# Altium project AOTF_signal_conversion_circuit_4.PrjPcb
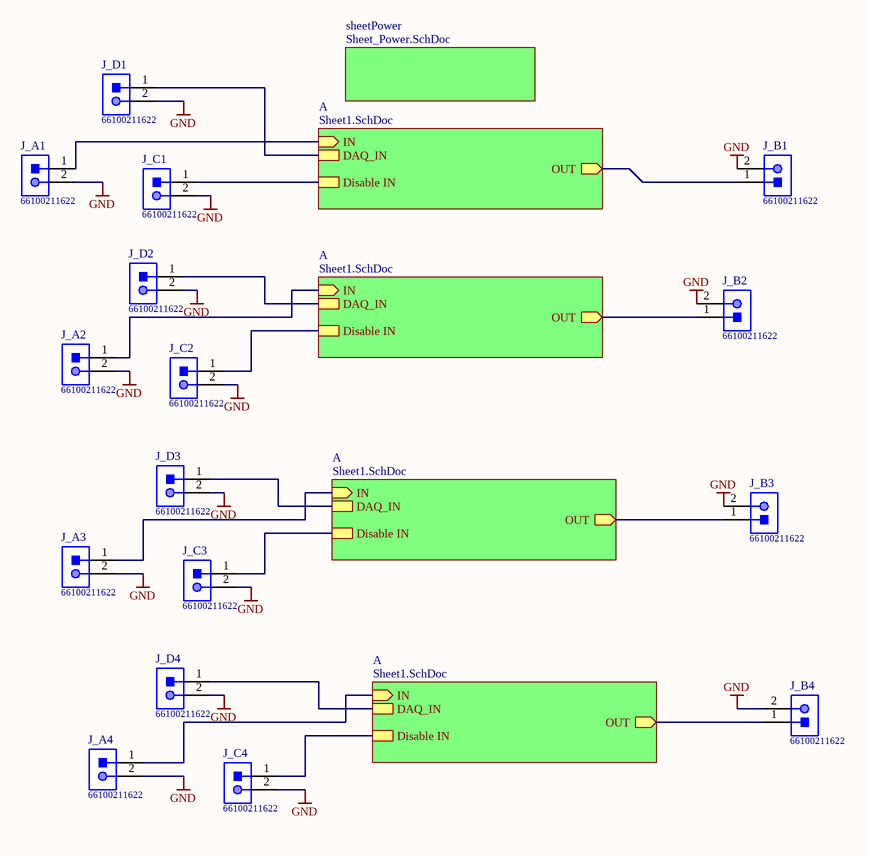
[diagram p0: sheet_top.SchDoc]
4 sheets, 136 parts. Net scope: hierarchical (ports join the sheet entries above them; power ports are global).
Board file: board.PcbDoc
Sheets:
  sheet_top.SchDoc
    sheetPower = Sheet_Power.SchDoc
    A = Sheet1.SchDoc
    A = Sheet1.SchDoc
    A = Sheet1.SchDoc
    A = Sheet1.SchDoc
  Sheet2.SchDoc

## Sheet sheet_top.SchDoc
size A4

### Parts
J_A1  66100211622  [66100211622]
J_A2  66100211622  [66100211622]
J_A3  66100211622  [66100211622]
J_A4  66100211622  [66100211622]
J_B1  66100211622  [66100211622]
J_B2  66100211622  [66100211622]
J_B3  66100211622  [66100211622]
J_B4  66100211622  [66100211622]
J_C1  66100211622  [66100211622]
J_C2  66100211622  [66100211622]
J_C3  66100211622  [66100211622]
J_C4  66100211622  [66100211622]
J_D1  66100211622  [66100211622]
J_D2  66100211622  [66100211622]
J_D3  66100211622  [66100211622]
J_D4  66100211622  [66100211622]

### Sub-sheets
A = Sheet1.SchDoc: OUT (out), IN (in), Disable IN, DAQ_IN
A = Sheet1.SchDoc: OUT (out), IN (in), Disable IN, DAQ_IN
A = Sheet1.SchDoc: OUT (out), IN (in), Disable IN, DAQ_IN
A = Sheet1.SchDoc: OUT (out), IN (in), Disable IN, DAQ_IN
sheetPower = Sheet_Power.SchDoc: no entries

### Nets
GND: J_A1.2 J_A2.2 J_A3.2 J_A4.2 J_B1.2 J_B2.2 J_B3.2 J_B4.2 J_C1.2 J_C2.2 J_C3.2 J_C4.2 J_D1.2 J_D2.2 J_D3.2 J_D4.2
NetJ_A1_1: J_A1.1 ; sheet A/IN
NetJ_A2_1: J_A2.1 ; sheet A/IN
NetJ_A3_1: J_A3.1 ; sheet A/IN
NetJ_A4_1: J_A4.1 ; sheet A/IN
NetJ_B1_1: J_B1.1 ; sheet A/OUT
NetJ_B2_1: J_B2.1 ; sheet A/OUT
NetJ_B3_1: J_B3.1 ; sheet A/OUT
NetJ_B4_1: J_B4.1 ; sheet A/OUT
NetJ_C1_1: J_C1.1 ; sheet A/Disable IN
NetJ_C2_1: J_C2.1 ; sheet A/Disable IN
NetJ_C3_1: J_C3.1 ; sheet A/Disable IN
NetJ_C4_1: J_C4.1 ; sheet A/Disable IN
NetJ_D1_1: J_D1.1 ; sheet A/DAQ_IN
NetJ_D2_1: J_D2.1 ; sheet A/DAQ_IN
NetJ_D3_1: J_D3.1 ; sheet A/DAQ_IN
NetJ_D4_1: J_D4.1 ; sheet A/DAQ_IN

### Notes on the sheet
- Title
- Size:
- Modified:
- A4
- Project:
- Time:
- Sheet
- of
- Created:
- Author:
- Prj. #:
- Alfons Riedinger
- File:
- Revision:

### Library data of the parts
J_A1-J_A4 J_B1-J_B4 J_C1-J_C4 J_D1-J_D4 = CMP-001-0161-A.3: WR-WTB 2.54 mm Male Vertical Shrouded Header 2 Pins; Manufacturer: Wurth Electronics; Supplier Part Number: 732-14102-ND; PartNumber: 66100211622; Supplier: Digi-Key

## Sheet Sheet_Power.SchDoc
size A4
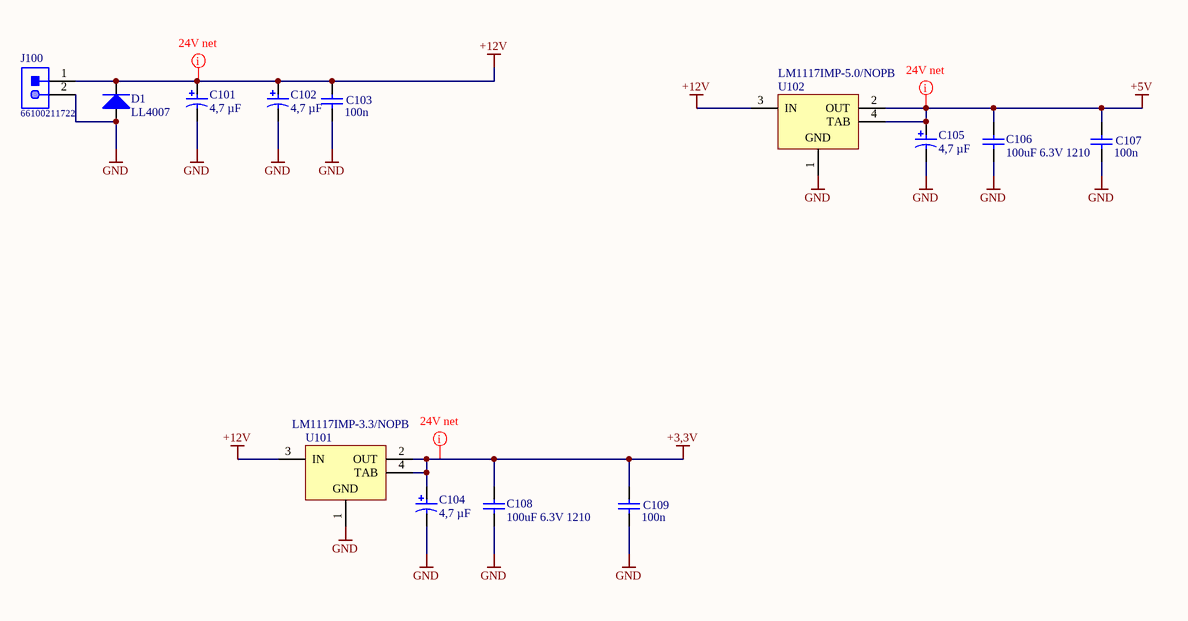
[diagram p1: Sheet_Power.SchDoc]

### Parts
C101  4,7 µF  [A Package]
C102  4,7 µF  [A Package]
C103  100n  [CAPC2013X88X50ML20T25]
C104  4,7 µF  [A Package]
C105  4,7 µF  [A Package]
C106  100uF 6.3V 1210  [885012109004-Footprint-1]
C107  100n  [CAPC2013X88X50ML20T25]
C108  100uF 6.3V 1210  [885012109004-Footprint-1]
C109  100n  [CAPC2013X88X50ML20T25]
D1  LL4007  [LL4007]
J100  66100211722  [66100211722]
U101  LM1117IMP-3.3/NOPB  [DCY0004A_N]
U102  LM1117IMP-5.0/NOPB  [DCY0004A_M]

### Nets
+3,3V: C104.1 C108.2 C109.2 U101.2(OUT) U101.4(TAB)
+5V: C105.1 C106.2 C107.2 U102.2(OUT) U102.4(TAB)
+12V: C101.1 C102.1 C103.2 D1.2(K) J100.1 U101.3(IN) U102.3(IN)
GND: C101.2 C102.2 C103.1 C104.2 C105.2 C106.1 C107.1 C108.1 C109.1 D1.1(A) J100.2 U101.1(GND) U102.1(GND)

### Layout directives
net class 24V_net: +3,3V, +5V, +12V

### Library data of the parts
C101 C102 C104 C105 = CMP-001-0039-3: 4,7 µF; 6V; Gr. A; T491A475K006AT; Manufacturer: KEMET; Capacitance: 4.7µF; ESR (Equivalent Series Resistance): 6 Ohm; Lifetime @ Temp.: 2000 Hrs @ 85°C; Tolerance: ±10%; Type: Molded; Voltage - Rated: 6.3V; ComponentLink1Description: KEM_T2005_T491.pdf; ComponentLink1URL: http://www.kemet.com/Lists/ProductCatalog/Attachments/254/KEM_T2005_T491.pdf; Failure Rate: -; Features: General Purpose; Height - Seated (Max): 0.071" (1.80mm); Lead Spacing: -; Manufacturer Size Code: A; Mounting Type: Surface Mount; Operating Temperature: -55°C ~ 125°C; Package / Case: 1206 (3216 Metric); Packaging: Cut Tape (CT); Part Status: Active; Size / Dimension: 0.126" L x 0.063" W (3.20mm x 1.60mm); Supplier: Digi-Key; Supplier Part Number: 399-9717-1-ND; PartNumber: T491A475K006AT
C103 C107 C109 = CMP-001-0082-2: generic 0805 COG oder X7R Vielschichtkondensatoren max. +/-10%
C106 C108 = CMP-001-0186-3: Ceramic Capacitor, Ceramic, 100uF, 6.3V; PartNumber: 885012109004; REACH SVHC: Yes; Dielectric Material: Ceramic; Capacitor Type: Ceramic; Number of Pins: 2; RoHS Compliant: Yes
D1 = CMP-001-0049-2: LL4007;  Vf 1,1V @ 1A, If = 1A; Manufacturer: TAIWAN SEMICONDUCTOR; PartNumber: LL4007G L2; Bauform - Diode: DO-213; Betriebstemperatur, max.: 175; Diodenkonfiguration: Einfach; Durchlassspannung Vf max.: 1.1; Durchlassstrom (mittlerer) If(AV): 1; Spitzendurchlassstrom Ifsm, max.: 25; SVHC: No SVHC (20-Jun-2016; Verpackung: Gurtabschnitt; Anzahl der Pins: -; ComponentLink1Description: 2182652.pdf; ComponentLink1URL: http://www.farnell.com/datasheets/2182652.pdf; Periodische Sperrspannung Vrrm, max.: 1; Produktpalette: -; Sperrerholzeit Trr, max.: -; Supplier: Farnell; Supplier Part Number: 2677381
J100 = CMP-00524-A.1: Intercom Male Shrouded Locking Header WR-WTB, THT, Right Angled, pitch 2.54 mm, 1 x 2 position; Manufacturer: Wurth Elektronik; Pitch: 2.54mm; Working Voltage: 50VAC; Contact Resistance: 20mOhm; Position: 1x2; Gender: Male; Manufacturer URL: http://www.we-online.de; Operating Temperature: -40to125degC; Packaging: Box; Package Reference: 66100211722; Part Number: 66100211722; Mounting Technology: THT; Datasheet URL: https://katalog.we-online.de/em/datasheet/6610xx11722.pdf; Orientation: RightAngled; Publisher: WurthElektronik
U101 = CMP-00484-1: 800mA Low-Dropout Linear Regulator, 4-pin SOT-223, Pb-Free; Manufacturer: Texas Instruments; PackageTopMarking: XYTT*N05B; PowerWise: N; High-Reliability: Y; CompType: LDO IC; Code_IPC: SOT223-4; PackageReference: DCY0004A; PinCount: 4; PackageDescription: Molded SOT-223, 6.50 x 3.56 x 1.6mm Body, 4 Lead, 2.3mm Pitch; PartNumber: LM1117IMP-3.3/NOPB; RoHS: Y; ComponentLink1Description: Datasheet URL; Code_JEDEC: TO-261-AA; ComponentLink1URL: http://www.ti.com/general/docs/lit/getliterature.tsp?genericPartNumber=LM1117-N&fileType=pdf
U102 = CMP-00485-1: 800mA Low-Dropout Linear Regulator, 4-pin SOT-223, Pb-Free; Manufacturer: Texas Instruments; PackageTopMarking: XYTT*N06B; CompType: LDO IC; PowerWise: N; High-Reliability: Y; RoHS: Y; Code_JEDEC: TO-261-AA; ComponentLink1URL: http://www.ti.com/general/docs/lit/getliterature.tsp?genericPartNumber=LM1117-N&fileType=pdf; Code_IPC: SOT223-4; ComponentLink1Description: Datasheet URL; PartNumber: LM1117IMP-5.0/NOPB; PackageReference: DCY0004A; PinCount: 4; PackageDescription: Molded SOT-223, 6.50 x 3.56 x 1.6mm Body, 4 Lead, 2.3mm Pitch

## Sheet Sheet1.SchDoc
size A4; Author: Christian Kieser; Engineer: Christian Kieser
Used 4 times, as channels A, A, A, A. Parts and nets are listed once, with the designators drawn on the sheet.
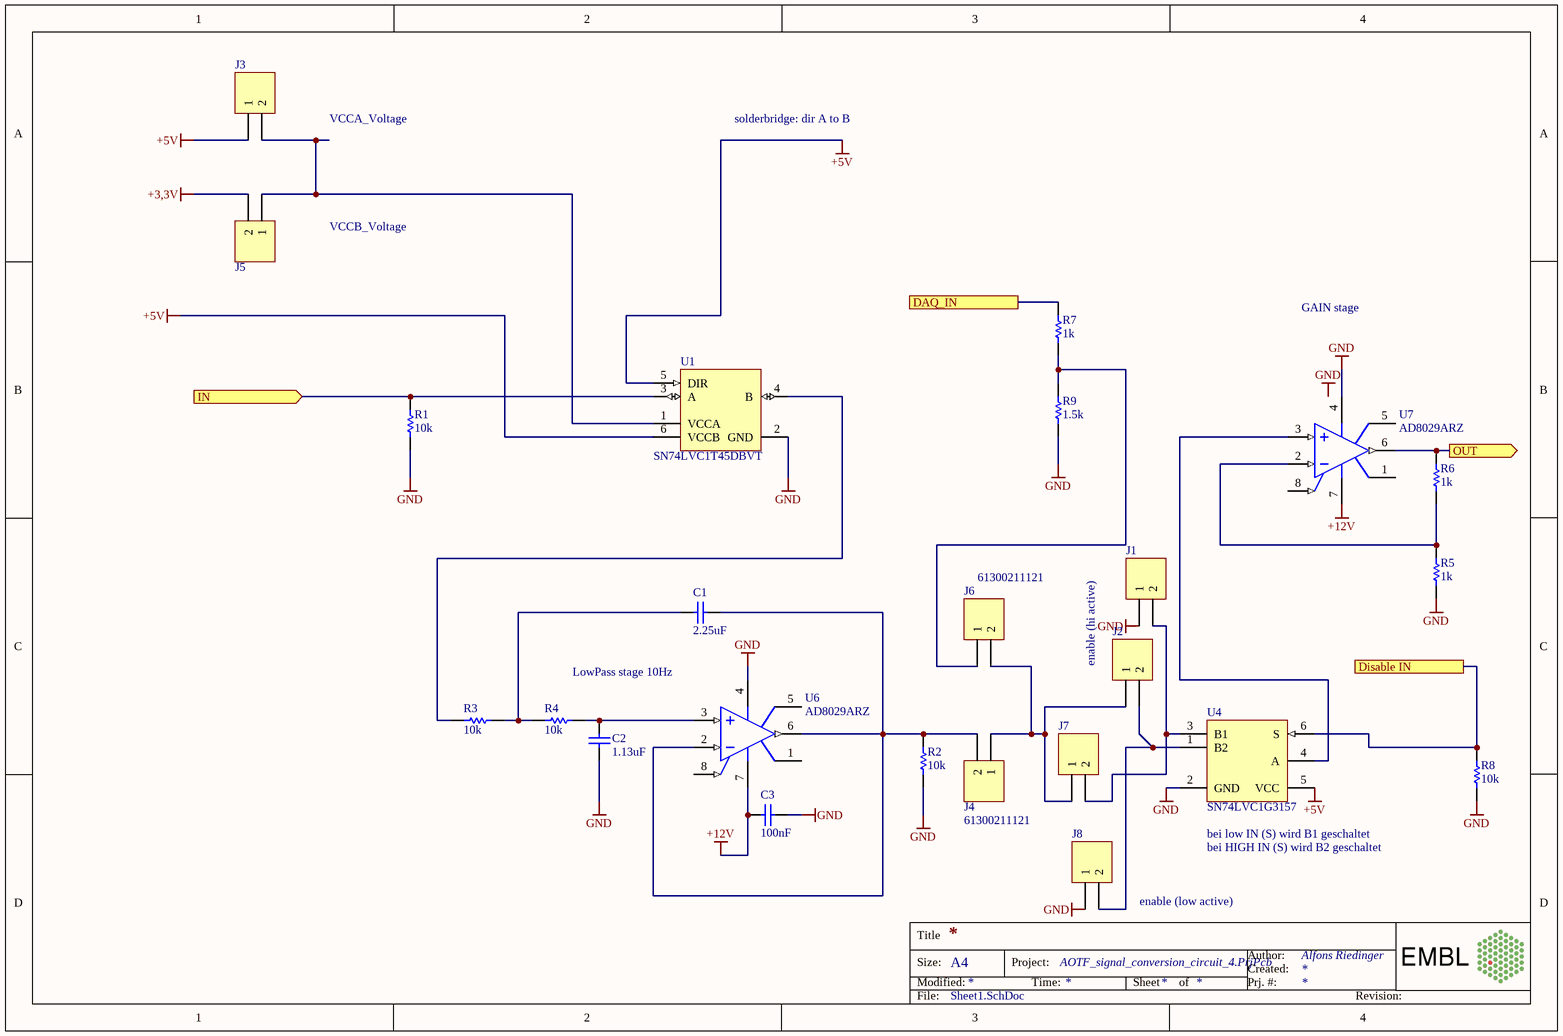
[diagram p2: Sheet1.SchDoc]

### Parts
C1  2.25uF  [CAPC1206(3216)190_N]
C2  1.13uF  [CAPC1206(3216)190_N]
C3  100nF  [CAPC2013X88X50ML20T25]
J1  61300211121  [61300211121]  (value not drawn)
J2  61300211121  [61300211121]  (value not drawn)
J3  61300211121  [61300211121]  (value not drawn)
J4  61300211121  [61300211121]
J5  61300211121  [61300211121]  (value not drawn)
J6  61300211121  [61300211121]
J7  61300211121  [61300211121]  (value not drawn)
J8  61300211121  [61300211121]  (value not drawn)
R1  10k  [YAGO-RC0805_M]
R2  10k  [YAGO-RC0805_M]
R3  10k  [YAGO-RC0805_M]
R4  10k  [YAGO-RC0805_M]
R5  1k  [YAGO-RC0805_M]
R6  1k  [YAGO-RC0805_M]
R7  1k  [YAGO-RC0805_M]
R8  10k  [YAGO-RC0805_M]
R9  1.5k  [YAGO-RC0805_M]
U1  SN74LVC1T45DBVT  [DBV0006A_M]
U4  SN74LVC1G3157  [DBV0006A_N]
U6  AD8029ARZ  [ADI-R-8_L]
U7  AD8029ARZ  [ADI-R-8_L]

### Ports
DAQ_IN, Disable IN, IN (in), OUT (out)

### Nets
+3,3V: J5.2
+5V: J3.1 U1.5(DIR) U1.6(VCCB) U4.5(VCC)
+12V: C3.2 U6.7(+VS) U7.7(+VS)
GND: C2.1 C3.1 J1.1 J8.1 R1.1 R2.1 R5.1 R8.2 R9.1 U1.2(GND) U4.2(GND) U6.4(-VS) U7.4(-VS)
DAQ_IN: R7.2 ; port DAQ_IN
Disable IN: R8.1 U4.6(S) ; port Disable IN
IN: R1.2 U1.3(A) ; port IN
OUT: R6.2 U7.6(VOUT) ; port OUT
NetC1_1: C1.1 R3.1 R4.2
NetC1_2: C1.2 J4.2 R2.2 U6.2(-IN) U6.6(VOUT)
NetC2_2: C2.2 R4.1 U6.3(+IN)
NetJ1_2: J1.2 J7.2 U4.3(B1)
NetJ2_1: J2.1 J4.1 J6.2 J7.1
NetJ2_2: J2.2 J8.2 U4.1(B2)
NetJ3_2: J3.2 J5.1 U1.1(VCCA)
NetJ6_1: J6.1 R7.1 R9.2
NetR3_2: R3.2 U1.4(B)
NetR5_2: R5.2 R6.1 U7.2(-IN)
NetU4_4: U4.4(A) U7.3(+IN)

Not connected (* = marked no-connect by the designer): U6 1(NC) 5(NC) 8(~{DISABLE}); U7 1(NC) 5(NC) 8(~{DISABLE})

### Channels
A: designators end in _A4; ports DAQ_IN=NetJ_D1_1 Disable IN=NetJ_C1_1 IN=NetJ_A1_1 OUT=NetJ_B1_1
A: designators end in _A3; ports DAQ_IN=NetJ_D2_1 Disable IN=NetJ_C2_1 IN=NetJ_A2_1 OUT=NetJ_B2_1
A: designators end in _A2; ports DAQ_IN=NetJ_D3_1 Disable IN=NetJ_C3_1 IN=NetJ_A3_1 OUT=NetJ_B3_1
A: designators end in _A1; ports DAQ_IN=NetJ_D4_1 Disable IN=NetJ_C4_1 IN=NetJ_A4_1 OUT=NetJ_B4_1

### Notes on the sheet
- VCCA_Voltage
- solderbridge: dir A to B
- VCCB_Voltage
- GAIN stage
- LowPass stage 10Hz
- enable (hi active)
- (near U4) bei low IN (S) wird B1 geschaltet
- bei HIGH IN (S) wird B2 geschaltet
- (near J8) enable (low active)
- Labels drawn without touching a wire or pin: GND
- Title
- Size:
- Modified:
- A4
- Project:
- Time:
- Sheet
- of
- Created:
- Author:
- Prj. #:
- Alfons Riedinger
- File:
- Revision:

### Library data of the parts
C1 C2 = CMP-001-0138-A.1: CAP CER 1UF 10V X7R 1206; Manufacturer: Wurth Electronics Inc.; Manufacturer Part Number: 885012208013; Notification: Current market demand for these product types have resulted in fluctuating and extending lead times. Lead times may differ.; Tolerance: ±10%; Applications: General Purpose; ComponentLink1Description: 885012208013.pdf; ComponentLink1URL: http://katalog.we-online.de/pbs/datasheet/885012208013.pdf; Features: -; Height - Seated (Max): -; Lead Spacing: -; Lead Style: -; Mounting Type: Surface Mount, MLCC; Operating Temperature: -55°C ~ 125°C; Package / Case: 1206 (3216 Metric); Packaging: Cut Tape (CT); Part Status: Active; Ratings: -; Size / Dimension: 0.126" L x 0.063" W (3.20mm x 1.60mm); Supplier: Digi-Key; Supplier Part Number: 732-7685-1-ND; Temperature Coefficient: X7R; Thickness (Max): 0.051" (1.30mm); Voltage - Rated: 10V
C3 = CMP-001-0082-2: as C103 on sheet Sheet_Power
J1-J8 = CMP-001-0071-1: 2Pol; gerade; WR-PHD 2.54 mm THT Pin Header; Brand: Wurth Electronics; Current Rating: 3 A; Insulation Resistance: 1 GOhms; Latching Type: Unlatched; Mating Post Length: 6 mm; Mounting Angle: Straight; Number of Positions: 2 Position; Pitch: 2.54 mm; Voltage Rating: 250 V; Accessory Type: -; Application: Wire to Board; ComponentLink1Description: 6130xx11121-538006.pdf; ComponentLink1URL: http://www.mouser.com/ds/2/445/6130xx11121-538006.pdf; Contact Gender: Pin (Male); Contact Material: Copper Alloy; Contact Plating: Gold; Contact Type: -; Flammability Rating: UL 94 V-0; Housing Gender: -; Housing Material: Polybutylene Terephthalate (PBT); Manufacturer: Wurth Electronics; Manufacturer Part Number: 61300211121; Minimum Order Quantity: 1; Mounting Style: Straight Pin; Number of Rows: 1 Row; Packaging: Bulk; Product: Headers; Reeling: False; RoHS - Mouser: Y; Row Spacing: -; Series: WR-PHD; Standard Pack Qty: 1000; Supplier: Mouser; Supplier Part Number: 710-61300211121; Termination Post Length: 3 mm; Termination Style: Through Hole; Type: Pin Strip; PartNumber: 61300211121
R1-R9 = CMP-001-0027-2: 0805 Yageo Standard BlackBox Resistors; Power (Watts): 0.125W, 1/8W; Temperature Coefficient: ±200ppm/°C; Tolerance: ±1%; ComponentLink1Description: PYu-RC_Group_51_RoHS_L_7.pdf; Part Status: Active; Size / Dimension: 0.079" L x 0.049" W (2.00mm x 1.25mm); Supplier Device Package: 0805; ComponentLink1URL: http://www.yageo.com/documents/recent/PYu-RC_Group_51_RoHS_L_7.pdf; Composition: Thick Film; Failure Rate: -; Features: Moisture Resistant; Height - Seated (Max): 0.024" (0.60mm); Manufacturer: Yageo; Operating Temperature: -55°C ~ 155°C; Package / Case: 0805 (2012 Metric); Packaging: Digi-Reel®
U1 = CMP-00492-1: Single-Bit Dual-Supply Bus Transceiver with Configurable Voltage Translation and 3-State Outputs, DBV0006A, SMALL T&R; Manufacturer: Texas Instruments; 3-State Output: Yes; VCC(Min)(V): 1.65; tpd @ Nom Voltage(Max)(ns): 15.5,8,5.8,4.4; Technology Family: LVC; Logic: True; Bits(#): 1; Rating: Catalog; Sub-Family: Dual Supply Translator; Schmitt Trigger: No; VCC(Max)(V): 5.5; Voltage(Nom)(V): 1.8,2.5,3.3,5; Output Drive (IOL/IOH)(Max)(mA): 32/-32; Input Type: CMOS/TTL; ICC @ Nom Voltage(Max)(mA): 0.004; Output Type: CMOS; F @ Nom Voltage(Max)(Mhz): 150; DatasheetVersion: SCES515K; Operating Temperature Range(C): -40 to 85; Generic Part Number: SN74LVC1T45; PackageReference: DBV0006A
U4 = CMP-001-0106-A.1: Analoger Schalter Single SPDT(Wechsler) SOT23-6; Manufacturer: Texas Instruments; Manufacturer Part Number: 74LVC1G3157DBVRE4; PartNumber: SN74LVC1G3157DBVR; -3db Bandwidth: 300MHz; Channel Capacitance (CS(off), CD(off)): 5.2pF; Channel-to-Channel Matching (&Delta;Ron): 100 mOhm; Charge Injection: 7pC; Crosstalk: -54dB @ 10MHz; Current - Leakage (IS(off)) (Max): 1µA; Multiplexer/Demultiplexer Circuit: 2:1; On-State Resistance (Max): 15 Ohm; Switch Time (Ton, Toff) (Max): 5.7ns, 3.8ns; Voltage - Supply, Single (V+): 1.65 V ~ 5.5 V; ComponentLink1Description: sn74lvc1g3157.pdf; ComponentLink1URL: http://www.ti.com/lit/ds/symlink/sn74lvc1g3157.pdf; Operating Temperature: -40°C ~ 85°C (TA); Package / Case: SOT-23-6; Packaging: Tape & Reel (TR); Part Status: Active; Supplier: Digi-Key; Supplier Device Package: SOT-23-6; Supplier Part Number: 74LVC1G3157DBVRE4-ND; Switch Circuit: SPDT; Voltage - Supply, Dual (V±): -
U6 U7 = CMP-00480-1: Single Channel RRIO Operational Amplifier, 125 MHz BW, 62 V/us SR, Industrial, 8-pin SOIC (R-8), Tube; Manufacturer: Analog Devices; Generic Part Number: AD8029; Slew Rate: 62V/us; V Span Min: 2.7V; Input Bias Current: 700nA; Amplifiers Per Package: 1; Iq/Amp: 1.5mA; V Span Max: 12V; Input Offset Voltage: 1.6mV; Small Signal Bandwidth: 125MHz; PackageVersion: 060506-A; ComponentLink3URL: http://www.analog.com/static/imported-files/packages/PKG_PDF/SOIC_Narrow%20(R)/R_8.pdf; ComponentLink1Description: Manufacturer URL; ComponentLink1URL: http://www.analog.com/en/index.html; Code_JEDEC: MS-012-AA; ComponentLink2URL: http://www.analog.com/static/imported-files/data_sheets/AD8029_8030_8040.pdf; ComponentLink3Description: Package Specification; PackageDescription: 8-Pin Standard Small Outline Package, Body 3.9 x 4.9 mm, Pitch 1.27 mm; PartNumber: AD8029ARZ; Mounting Technology: Surface Mount; PackageReference: R-8; DatasheetVersion: Rev. B; ComponentLink2Description: Datasheet

## Sheet Sheet2.SchDoc
size A4
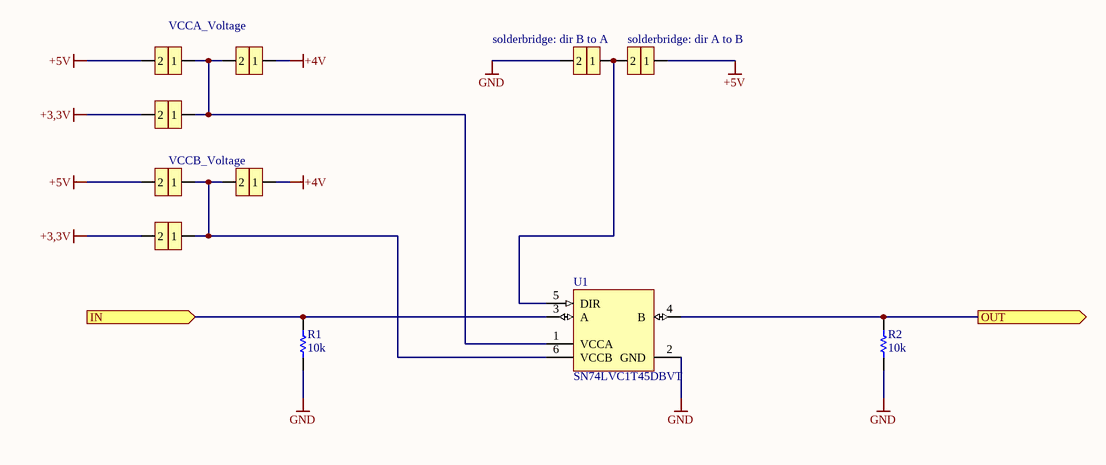
[diagram p3: Sheet2.SchDoc]

### Parts
J1  normal solderbridge  [PCBComponent]  (value not drawn)
J2  normal solderbridge  [PCBComponent]  (value not drawn)
J3  normal solderbridge  [PCBComponent]  (value not drawn)
J4  normal solderbridge  [PCBComponent]  (value not drawn)
J5  normal solderbridge  [PCBComponent]  (value not drawn)
J6  normal solderbridge  [PCBComponent]  (value not drawn)
J7  normal solderbridge  [PCBComponent]  (value not drawn)
J8  normal solderbridge  [PCBComponent]  (value not drawn)
R1  10k  [YAGO-RC0805_M]
R2  10k  [YAGO-RC0805_M]
U1  SN74LVC1T45DBVT  [DBV0006A_M]

### Ports
IN (in), OUT (out)

### Nets
+3,3V: J3.2 J6.2
+4V: J2.1 J5.1
+5V: J1.2 J4.2 J8.1
GND: J7.2 R1.1 R2.1 U1.2(GND)
NetJ1_1: J1.1 J2.2 J3.1 U1.1(VCCA)
NetJ4_1: J4.1 J5.2 J6.1 U1.6(VCCB)
NetJ7_1: J7.1 J8.2 U1.5(DIR)
NetR1_2: R1.2 U1.3(A) ; port IN
NetR2_2: R2.2 U1.4(B) ; port OUT

### Notes on the sheet
- VCCA_Voltage
- solderbridge: dir B to A
- (near J8) solderbridge: dir A to B
- VCCB_Voltage
- Title
- Size:
- Modified:
- A4
- Project:
- Time:
- Sheet
- of
- Created:
- Author:
- Prj. #:
- Alfons Riedinger
- File:
- Revision:

### Library data of the parts
J1-J8 = CMP-001-0133-A.1
R1 R2 = CMP-001-0027-2: as R1 on sheet Sheet1; ComponentLink1Description: PYu-RC_Group_51_RoHS_L_7.pdf; Part Status: Active; Size / Dimension: 0.079" L x 0.049" W (2.00mm x 1.25mm); Supplier Device Package: 0805; ComponentLink1URL: http://www.yageo.com/documents/recent/PYu-RC_Group_51_RoHS_L_7.pdf; Composition: Thick Film; Failure Rate: -; Features: Moisture Resistant; Height - Seated (Max): 0.024" (0.60mm); Manufacturer: Yageo; Operating Temperature: -55°C ~ 155°C; Package / Case: 0805 (2012 Metric); Packaging: Digi-Reel®
U1 = CMP-00491-1: Single-Bit Dual-Supply Bus Transceiver with Configurable Voltage Translation and 3-State Outputs, DBV0006A, SMALL T&R; Manufacturer: Texas Instruments; 3-State Output: Yes; VCC(Min)(V): 1.65; tpd @ Nom Voltage(Max)(ns): 15.5,8,5.8,4.4; Technology Family: LVC; Logic: True; Bits(#): 1; Rating: Catalog; Sub-Family: Dual Supply Translator; Schmitt Trigger: No; VCC(Max)(V): 5.5; Voltage(Nom)(V): 1.8,2.5,3.3,5; Output Drive (IOL/IOH)(Max)(mA): 32/-32; Input Type: CMOS/TTL; ICC @ Nom Voltage(Max)(mA): 0.004; Output Type: CMOS; F @ Nom Voltage(Max)(Mhz): 150; DatasheetVersion: SCES515K; Operating Temperature Range(C): -40 to 85; Generic Part Number: SN74LVC1T45; PackageReference: DBV0006A

## Nets that join several sheets
+3,3V: Sheet_Power (5 pins), A (J5_A4.2), A (J5_A3.2), A (J5_A2.2), A (J5_A1.2), Sheet2 (J3.2 J6.2)
+5V: Sheet_Power (5 pins), A (J3_A4.1 U1_A4.5 U1_A4.6 U4_A4.5), A (J3_A3.1 U1_A3.5 U1_A3.6 U4_A3.5), A (J3_A2.1 U1_A2.5 U1_A2.6 U4_A2.5), A (J3_A1.1 U1_A1.5 U1_A1.6 U4_A1.5), Sheet2 (J1.2 J4.2 J8.1)
+12V: Sheet_Power (7 pins), A (C3_A4.2 U6_A4.7 U7_A4.7), A (C3_A3.2 U6_A3.7 U7_A3.7), A (C3_A2.2 U6_A2.7 U7_A2.7), A (C3_A1.2 U6_A1.7 U7_A1.7)
GND: sheet_top (16 pins), Sheet_Power (13 pins), A (13 pins), A (13 pins), A (13 pins), A (13 pins), Sheet2 (J7.2 R1.1 R2.1 U1.2)
NetJ_A1_1: sheet_top (J_A1.1), A (R1_A4.2 U1_A4.3)
NetJ_A2_1: sheet_top (J_A2.1), A (R1_A3.2 U1_A3.3)
NetJ_A3_1: sheet_top (J_A3.1), A (R1_A2.2 U1_A2.3)
NetJ_A4_1: sheet_top (J_A4.1), A (R1_A1.2 U1_A1.3)
NetJ_B1_1: sheet_top (J_B1.1), A (R6_A4.2 U7_A4.6)
NetJ_B2_1: sheet_top (J_B2.1), A (R6_A3.2 U7_A3.6)
NetJ_B3_1: sheet_top (J_B3.1), A (R6_A2.2 U7_A2.6)
NetJ_B4_1: sheet_top (J_B4.1), A (R6_A1.2 U7_A1.6)
NetJ_C1_1: sheet_top (J_C1.1), A (R8_A4.1 U4_A4.6)
NetJ_C2_1: sheet_top (J_C2.1), A (R8_A3.1 U4_A3.6)
NetJ_C3_1: sheet_top (J_C3.1), A (R8_A2.1 U4_A2.6)
NetJ_C4_1: sheet_top (J_C4.1), A (R8_A1.1 U4_A1.6)
NetJ_D1_1: sheet_top (J_D1.1), A (R7_A4.2)
NetJ_D2_1: sheet_top (J_D2.1), A (R7_A3.2)
NetJ_D3_1: sheet_top (J_D3.1), A (R7_A2.2)
NetJ_D4_1: sheet_top (J_D4.1), A (R7_A1.2)